# Altium schematic sheet DWM1000_Basic_Board.SchDoc
size A
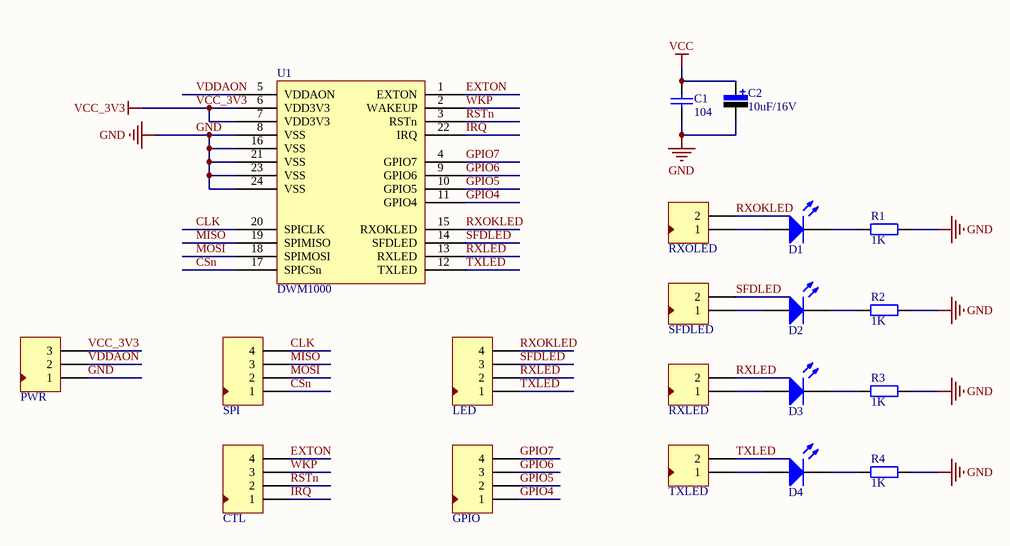
[diagram p0: DWM1000_Basic_Board.SchDoc]

## Parts
C1  value 104  [C-0603]  (hidden comment: Cap-S)
C2  value 10uF/16V  [1206]  (hidden comment: Cap-Pol)
CTL  Header 4  [HDR4X1-2.54]  (value not drawn)
D1  LED0  [0603-1]  (value not drawn)
D2  LED0  [0603-1]  (value not drawn)
D3  LED0  [0603-1]  (value not drawn)
D4  LED0  [0603-1]  (value not drawn)
GPIO  Header 4  [XH2.54-4P]  (value not drawn)
LED  Header 4  [XH2.54-4P]  (value not drawn)
PWR  Header 3  [HDR3X1-2.54]  (value not drawn)
R1  value 1K  [0603-1]  (hidden comment: Res1)
R2  value 1K  [0603-1]  (hidden comment: Res1)
R3  value 1K  [0603-1]  (hidden comment: Res1)
R4  value 1K  [0603-1]  (hidden comment: Res1)
RXLED  Header 2  [HDR2X1-2.54]  (value not drawn)
RXOLED  Header 2  [HDR2X1-2.54]  (value not drawn)
SFDLED  Header 2  [HDR2X1-2.54]  (value not drawn)
SPI  Header 4  [HDR4X1-2.54]  (value not drawn)
TXLED  Header 2  [HDR2X1-2.54]  (value not drawn)
U1  DWM1000  [DWM1000]

## Nets
GND: C1.1 C2.2 PWR.1 R1.2 R2.2 R3.2 R4.2 U1.8(VSS) U1.16(VSS) U1.21(VSS) U1.23(VSS) U1.24(VSS)
VCC: C1.2 C2.1
VCC_3V3: PWR.3 U1.6(VDD3V3) U1.7(VDD3V3)
CLK: SPI.4 U1.20(SPICLK)
CSn: SPI.1 U1.17(SPICSn)
EXTON: CTL.4 U1.1(EXTON)
GPIO4: GPIO.1 U1.11(GPIO4)
GPIO5: GPIO.2 U1.10(GPIO5)
GPIO6: GPIO.3 U1.9(GPIO6)
GPIO7: GPIO.4 U1.4(GPIO7)
IRQ: CTL.1 U1.22(IRQ)
MISO: SPI.3 U1.19(SPIMISO)
MOSI: SPI.2 U1.18(SPIMOSI)
RSTn: CTL.2 U1.3(RSTn)
RXLED: LED.2 RXLED.2 U1.13(RXLED)
RXOKLED: LED.4 RXOLED.2 U1.15(RXOKLED)
SFDLED: LED.3 SFDLED.2 U1.14(SFDLED)
TXLED: LED.1 TXLED.2 U1.12(TXLED)
VDDAON: PWR.2 U1.5(VDDAON)
WKP: CTL.3 U1.2(WAKEUP)
NetD1_1: D1.1(A) RXOLED.1
NetD1_2: D1.2(K) R1.1
NetD2_1: D2.1(A) SFDLED.1
NetD2_2: D2.2(K) R2.1
NetD3_1: D3.1(A) RXLED.1
NetD3_2: D3.2(K) R3.1
NetD4_1: D4.1(A) TXLED.1
NetD4_2: D4.2(K) R4.1

## Library data of the parts
C1 = Cap-S: 贴片瓷片电容; Published: 8-Jun-2000; LatestRevisionDate: 17-Jul-2002; LatestRevisionNote: Re-released for DXP Platform.; PackageReference: RAD-0.3; Publisher: Altium Limited
C2 = Cap-Pol: 贴片电解电容; Published: 8-Jun-2000; LatestRevisionDate: 17-Jul-2002; LatestRevisionNote: Re-released for DXP Platform.; PackageReference: RB7.6-15; Publisher: Altium Limited
CTL GPIO LED SPI = Header 4: 接插件; LatestRevisionDate: 17-Jul-2002; LatestRevisionNote: Re-released for DXP Platform.; Publisher: Altium Limited
D1-D4 = LED0: 发光二极管; Published: 8-Jun-2000; LatestRevisionDate: 08-Jul-2005; LatestRevisionNote: Mech Layer 1 removed.; PackageReference: LED-0; Publisher: Altium Limited
PWR = Header 3: 接插件; LatestRevisionDate: 17-Jul-2002; LatestRevisionNote: Re-released for DXP Platform.; Publisher: Altium Limited
R1-R4 = Res1: 贴片电阻; Published: 8-Jun-2000; LatestRevisionDate: 17-Jul-2002; LatestRevisionNote: Re-released for DXP Platform.; PackageReference: AXIAL-0.4; Publisher: Altium Limited
RXLED RXOLED SFDLED TXLED = Header 2: 接插件; LatestRevisionDate: 17-Jul-2002; LatestRevisionNote: Re-released for DXP Platform.; Publisher: Altium Limited